# EAGLE board cape (EAGLE 9.4.2)
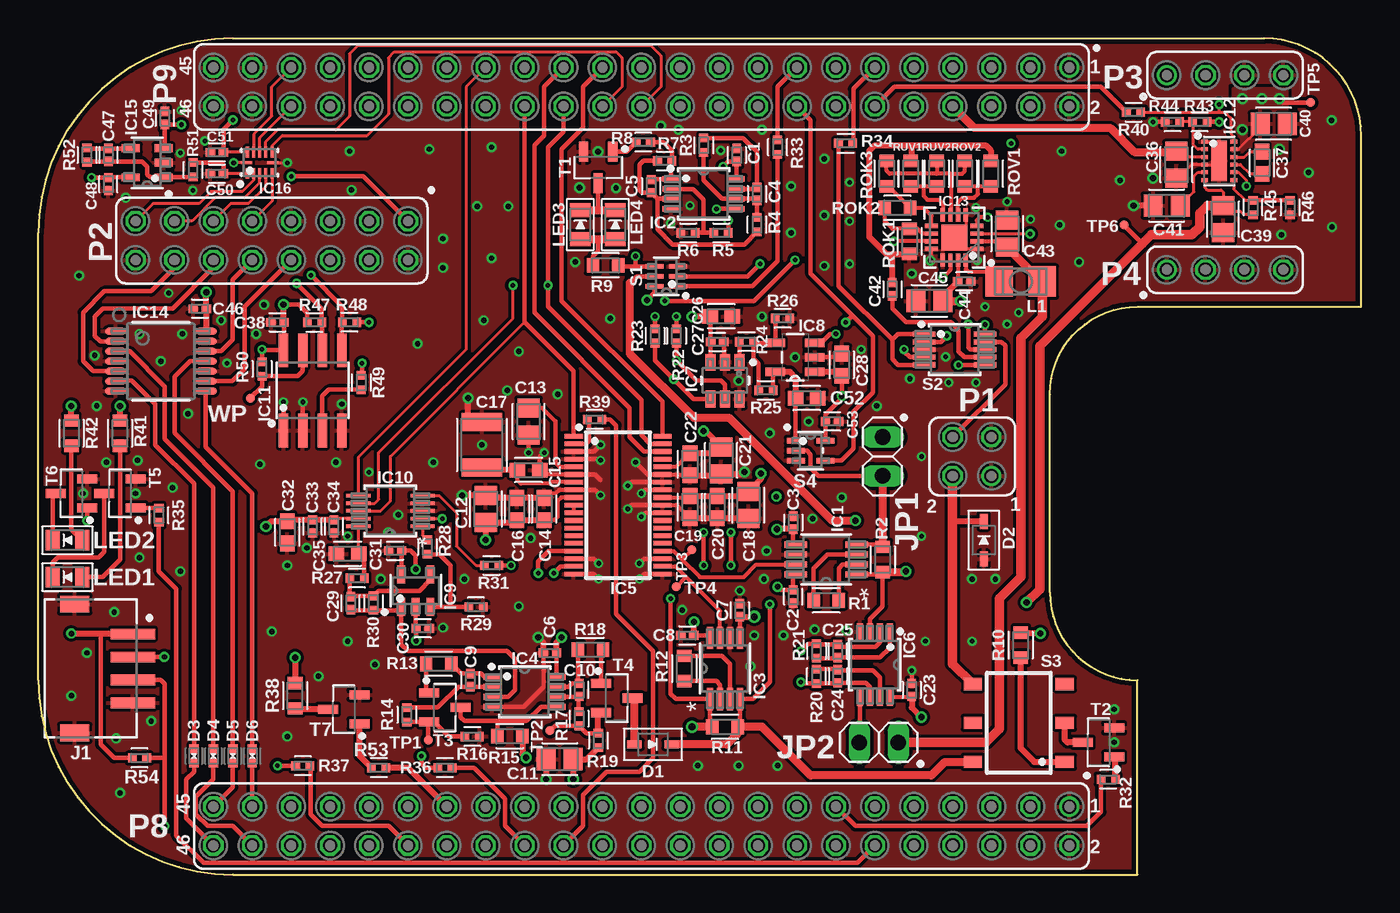
[diagram p8: board, top side]
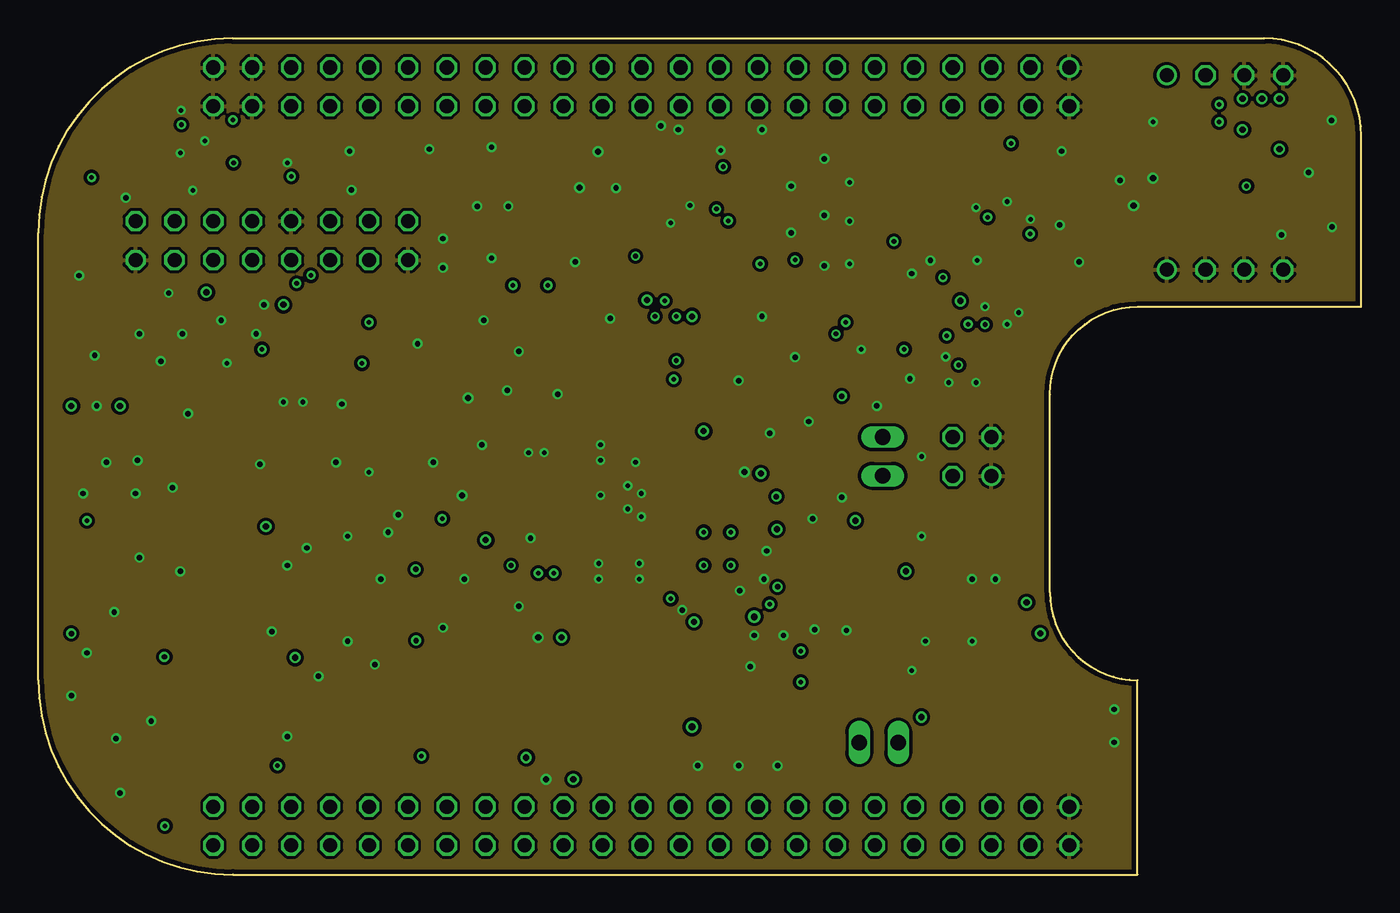
[diagram p9: board, inner layer Ground]
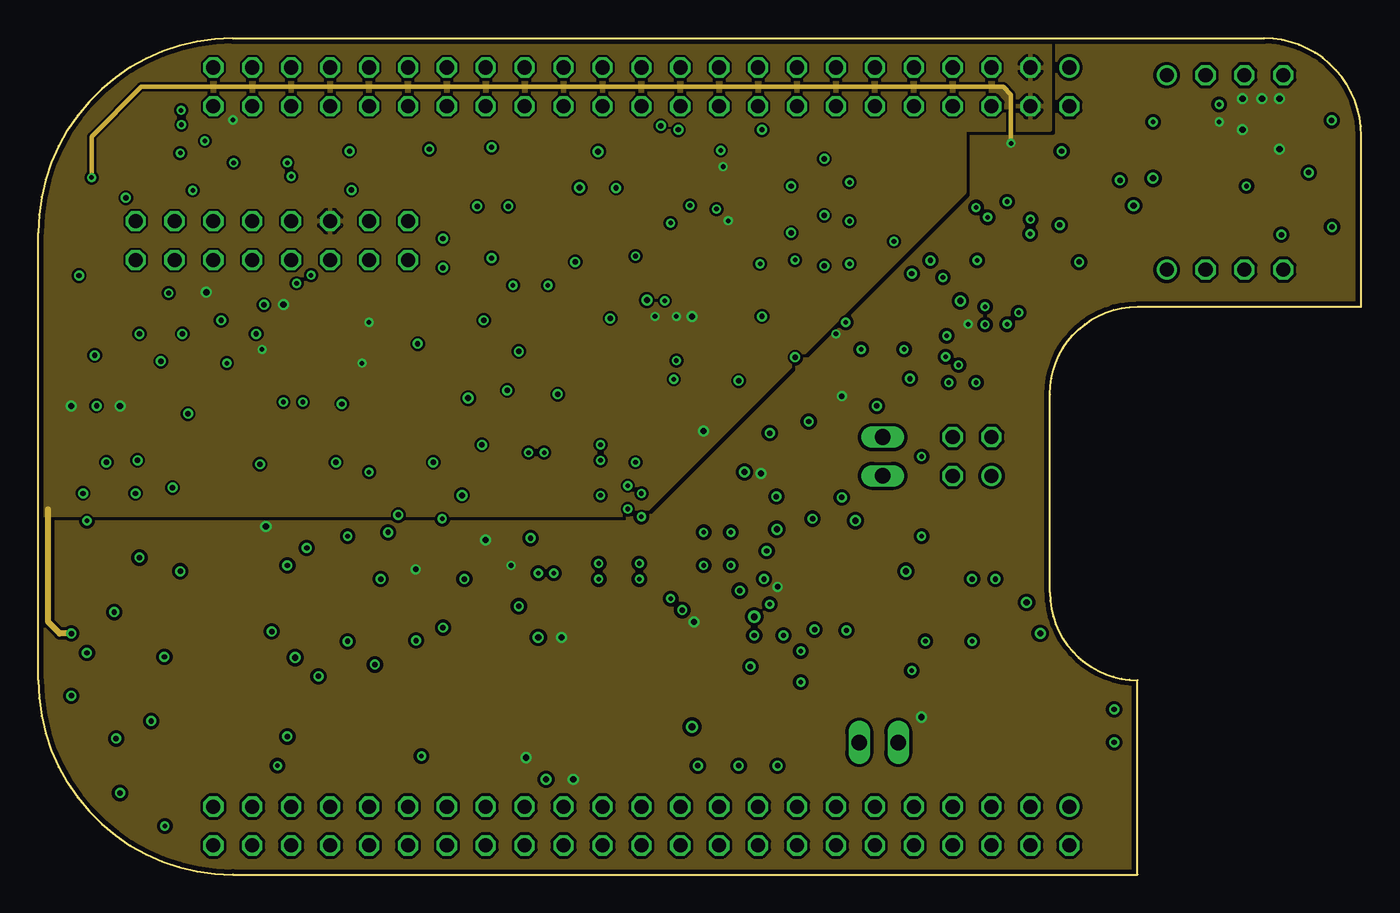
[diagram p10: board, inner layer Power]
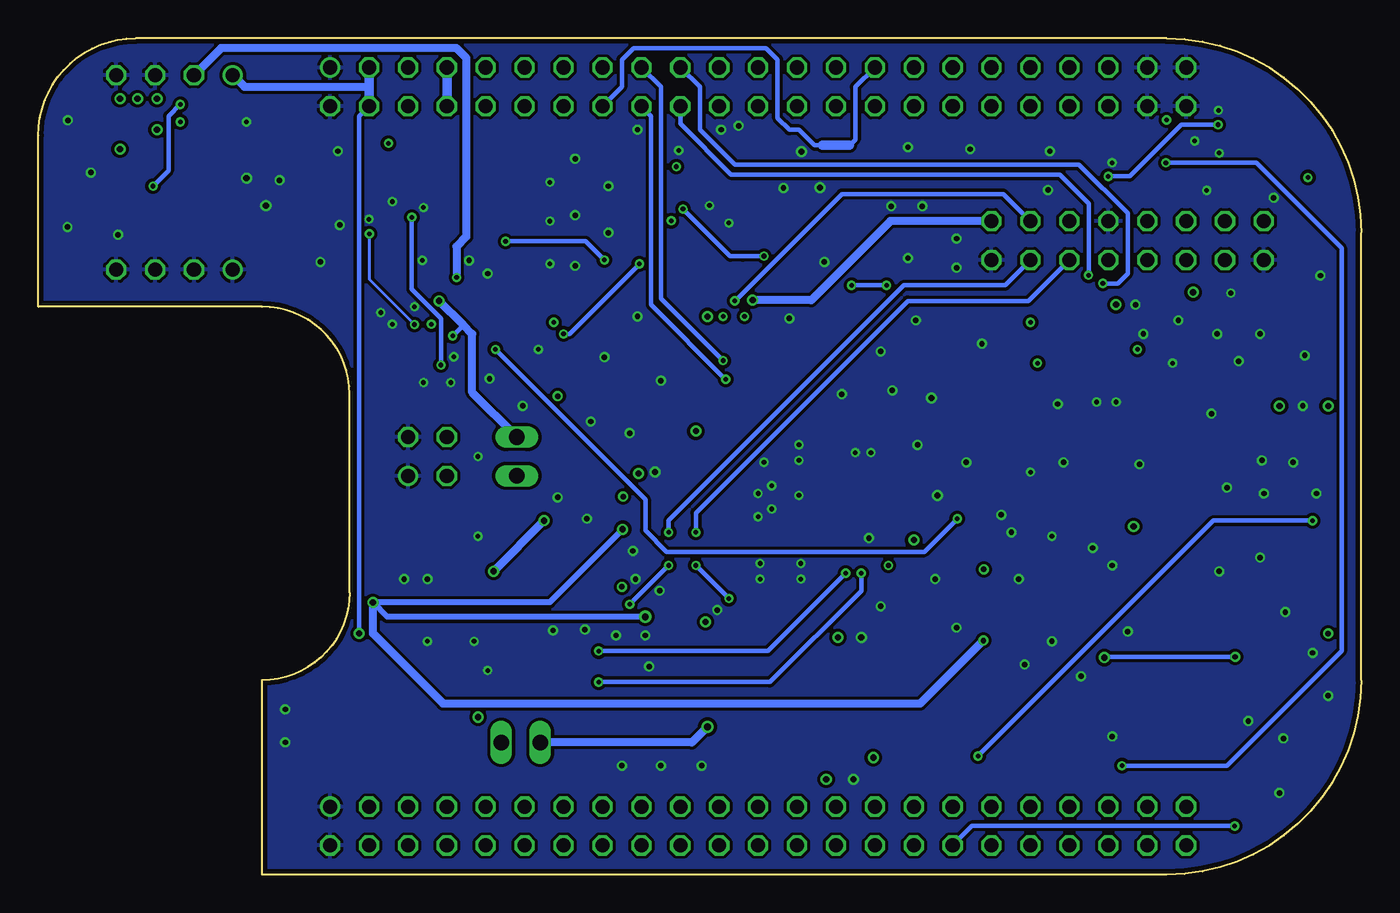
[diagram p11: board, bottom side, seen from below]

Size 86.36 x 54.61 mm. Coordinates in mm from the lower left corner, seen from the top.
Outline: 0,12.7 arc90 12.7,0 71.75,0 71.75,12.7 arc-90 66.04,18.41 66.04,31.37 arc-90 71.75,37.08 86.36,37.08 86.36,48.26 arc90 80.01,54.61 12.7,54.61 arc90 0,41.91 0,12.7
Copper layers (1+2*15+16): Top 0.035mm / dielectric 0.38mm / Ground 0.035mm / dielectric 0.71mm / Power 0.035mm / dielectric 0.38mm / Bottom 0.035mm
Design rules "PCB-POOL Standard_ML4 *": minimum track width 0.15mm, minimum drill 0.3mm, track to track 0.15mm, track to pad 0.15mm, pad to pad 0.15mm, via to via 0.15mm, smd to smd 0.15mm, copper to edge 0.3mm, drill to drill 0.2mm, minimum pad ring 0.2mm, minimum via ring 0.15mm, stop-mask expansion 0.075mm, vias tented up to drill 20mil, thermal gap 0.2mm
tKeepout: area 68.6,15.9 to 86.4,34.3

## Footprints (pad centres in the part's own frame; a part is rotated, then mirrored left to right if it is on the bottom)
CAPC1005X55 = smd 0.608 x 0.562: 1 -0.427,0; 2 0.427,0
CAPC2012X145 = smd 1.234 x 1.453: 1 -0.884,0; 2 0.884,0
CAPC1608X95 = smd 1.024 x 0.954: 1 -0.725,0; 2 0.725,0
CAPC3225X280 = smd 1.178 x 2.625: 1 -1.477,0; 2 1.477,0
SOD2513X110 = smd 0.965 x 0.508: 1 -1.225,0; 2 1.225,0
DIOC1005X55N = smd 0.56 x 0.6: 1 -0.47,0; 2 0.47,0
RM_8-L = smd 1.456 x 0.4: 1 -1.999,0.975; 2 -1.999,0.325; 3 -1.999,-0.325; 4 -1.999,-0.975; 5 1.999,-0.975; 6 1.999,-0.325; 7 1.999,0.325; 8 1.999,0.975
DGK8-L = smd 1.118 x 0.381: 1 -2.121,0.975; 2 -2.121,0.325; 3 -2.121,-0.325; 4 -2.121,-0.975; 5 2.121,-0.975; 6 2.121,-0.325; 7 2.121,0.325; 8 2.121,0.975
TSSOP38 = smd 0.3 x 1.2: 1 -4.5,-2.9; 2 -4,-2.9; 3 -3.5,-2.9; 4 -3,-2.9; 5 -2.5,-2.9; 6 -2,-2.9; 7 -1.5,-2.9; 8 -1,-2.9; 9 -0.5,-2.9; 10 0,-2.9; 11 0.5,-2.9; 12 1,-2.9; 13 1.5,-2.9; 14 2,-2.9; 15 2.5,-2.9; 16 3,-2.9; 17 3.5,-2.9; 18 4,-2.9; 19 4.5,-2.9; 20 4.5,2.9; 21 4,2.9; 22 3.5,2.9; 23 3,2.9; 24 2.5,2.9; 25 2,2.9; 26 1.5,2.9; 27 1,2.9; 28 0.5,2.9; 29 0,2.9; 30 -0.5,2.9; 31 -1,2.9; 32 -1.5,2.9; 33 -2,2.9; 34 -2.5,2.9; 35 -3,2.9; 36 -3.5,2.9; 37 -4,2.9; 38 -4.5,2.9
DAC6571IDBVR = smd 1.1 x 0.65: 1 -1.2,0.95; 2 -1.2,0; 3 -1.2,-0.95; 4 1.2,-0.95; 5 1.2,0; 6 1.2,0.95
SOT95P280X145-5N = smd 1.27 x 0.559: 1 -1.295,0.94; 2 -1.295,0; 3 -1.295,-0.94; 4 1.295,-0.94; 5 1.295,0.94
DBV5-L = smd 1.168 x 0.508: 1 -1.067,0.95; 2 -1.067,0; 3 -1.067,-0.95; 4 1.067,-0.95; 5 1.067,0.95
DGS10 = smd 1.575 x 0.229: 1 -2.095,1; 2 -2.095,0.5; 3 -2.095,0; 4 -2.095,-0.5; 5 -2.095,-1; 6 2.095,-1; 7 2.095,-0.5; 8 2.095,0; 9 2.095,0.5; 10 2.095,1
SO08 = smd 0.61 x 2.21: 1 -1.905,-2.616; 2 -0.635,-2.616; 3 0.635,-2.616; 4 1.905,-2.616; 5 1.905,2.616; 6 0.635,2.616; 7 -0.635,2.616; 8 -1.905,2.616
VREG_LM27762DSSR = smd 0.5 x 0.25: 1 -0.95,1.25; 2 -0.95,0.75; 3 -0.95,0.25; 4 -0.95,-0.25; 5 -0.95,-0.75; 6 -0.95,-1.25; 7 0.95,-1.25; 8 0.95,-0.75; 9 0.95,-0.25; 10 0.95,0.25; 11 0.95,0.75; 12 0.95,1.25 | smd 1 x 2.65: 13 0,0
RGT16_1P7X1P7 = smd 0.85 x 0.28: 1 -1.475,0.75; 2 -1.475,0.25; 3 -1.475,-0.25; 4 -1.475,-0.75; 9 1.475,-0.75; 10 1.475,-0.25; 11 1.475,0.25; 12 1.475,0.75 | smd 0.28 x 0.85: 5 -0.75,-1.475; 6 -0.25,-1.475; 7 0.25,-1.475; 8 0.75,-1.475; 13 0.75,1.475; 14 0.25,1.475; 15 -0.25,1.475; 16 -0.75,1.475 | smd 1.7 x 1.7: 17 0,0
PW0014A_N = smd 1.4 x 0.45: 1 -2.95,1.95; 2 -2.95,1.3; 3 -2.95,0.65; 4 -2.95,0; 5 -2.95,-0.65; 6 -2.95,-1.3; 7 -2.95,-1.95; 8 2.95,-1.95; 9 2.95,-1.3; 10 2.95,-0.65; 11 2.95,0; 12 2.95,0.65; 13 2.95,1.3; 14 2.95,1.95
RUT0012A = smd 0.7 x 0.2: 1 -0.7,0.8; 2 -0.7,0.4; 3 -0.7,0; 4 -0.7,-0.4; 5 -0.7,-0.8; 7 0.7,-0.8; 8 0.7,-0.4; 9 0.7,0; 10 0.7,0.4; 11 0.7,0.8 | smd 0.2 x 0.7: 6 0,-0.85; 12 0,0.85
JST_S4B-ZR-SM4A-TF_0 = smd 0.7 x 2.9: 1 2.25,-2.75; 2 0.75,-2.75; 3 -0.75,-2.75; 4 -2.25,-2.75 | smd 1.1 x 1.9: 5 -4.2,1.05; 6 4.2,1.05
1X02 = drill 1.016 long: 1 -1.27,0; 2 1.27,0
L3225P = smd 1.8 x 2: 1 -1.4,0; 2 1.4,0
LEDC2012X75 = smd 0.91 x 1.35: 1 -0.96,0; 2 0.96,0
FE02-2 = drill 0.914: 1 1.27,1.27 | drill 0.914 octagon: 2 1.27,-1.27; 3 -1.27,1.27; 4 -1.27,-1.27
FE08-2 = drill 0.914 octagon: 1 8.89,1.27; 2 8.89,-1.27; 3 6.35,1.27; 4 6.35,-1.27; 5 3.81,1.27; 6 3.81,-1.27; 7 1.27,1.27; 8 1.27,-1.27; 9 -1.27,1.27; 10 -1.27,-1.27; 11 -3.81,1.27; 12 -3.81,-1.27; 13 -6.35,1.27; 14 -6.35,-1.27; 15 -8.89,1.27; 16 -8.89,-1.27
FE04-1 = drill 0.914: 1 3.81,0 | drill 0.914 octagon: 2 1.27,0; 3 -1.27,0; 4 -3.81,0
FE23-2 = drill 0.914: 1 27.94,1.27 | drill 0.914 octagon: 2 27.94,-1.27; 3 25.4,1.27; 4 25.4,-1.27; 5 22.86,1.27; 6 22.86,-1.27; 7 20.32,1.27; 8 20.32,-1.27; 9 17.78,1.27; 10 17.78,-1.27; 11 15.24,1.27; 12 15.24,-1.27; 13 12.7,1.27; 14 12.7,-1.27; 15 10.16,1.27; 16 10.16,-1.27; 17 7.62,1.27; 18 7.62,-1.27; 19 5.08,1.27; 20 5.08,-1.27; 21 2.54,1.27; 22 2.54,-1.27; 23 0,1.27; 24 0,-1.27; 25 -2.54,1.27; 26 -2.54,-1.27; 27 -5.08,1.27; 28 -5.08,-1.27; 29 -7.62,1.27; 30 -7.62,-1.27; 31 -10.16,1.27; 32 -10.16,-1.27; 33 -12.7,1.27; 34 -12.7,-1.27; 35 -15.24,1.27; 36 -15.24,-1.27; 37 -17.78,1.27; 38 -17.78,-1.27; 39 -20.32,1.27; 40 -20.32,-1.27; 41 -22.86,1.27; 42 -22.86,-1.27; 43 -25.4,1.27; 44 -25.4,-1.27; 45 -27.94,1.27; 46 -27.94,-1.27
RESC1608X55 = smd 0.808 x 0.955: 1 -0.823,0; 2 0.823,0
RESC1005X40 = smd 0.56 x 0.6: 1 -0.47,0; 2 0.47,0
KS_6-L = smd 1.156 x 0.305: 1 -0.768,0.65; 2 -0.768,0; 3 -0.768,-0.65; 4 0.768,-0.65; 5 0.768,0; 6 0.768,0.65
RM_10-L = smd 1.473 x 0.33: 1 -1.994,1; 2 -1.994,0.5; 3 -1.994,0; 4 -1.994,-0.5; 5 -1.994,-1; 6 1.994,-1; 7 1.994,-0.5; 8 1.994,0; 9 1.994,0.5; 10 1.994,1
SOP06 = smd 0.8 x 1.2: 1 -2.54,-3; 2 0,-3; 3 2.54,-3; 4 2.54,3; 5 0,3; 6 -2.54,3
DCK5 = smd 1.168 x 0.356: 1 -0.965,0.65; 2 -0.965,0; 3 -0.965,-0.65; 4 0.965,-0.65; 5 0.965,0.65
SOT95P237X112-3 = smd 1.298 x 0.597: 1 -1.027,0.95; 2 -1.027,-0.95; 3 1.027,0
TP06R = smd 0.6 x 0.6: TP 0,0

## Placement (x,y rotation side)
C1  0.1u  [CAPC1005X55]  45.59,46.99 90 top
C2  0.1u  [CAPC1005X55]  49.28,18.16 270 top
C3  0.1u  [CAPC1005X55]  49.28,22.99 90 top
C4  1n  [CAPC1005X55]  46.91,44.45 90 top
C5  1n  [CAPC1005X55]  40.01,44.96 90 top
C6  0.1u  [CAPC1005X55]  33.4,14.48 180 top
C7  0.1u  [CAPC1005X55]  45.8,17.27 90 top
C8  0.1u  [CAPC1005X55]  42.37,15.62 180 top
C9  1n  [CAPC1005X55]  28.19,12.7 90 top
C10  2.2n  [CAPC1005X55]  35.31,12.06 90 top
C11  10u  [CAPC2012X145]  34.04,7.54 180 top
C12  10u  [CAPC2012X145]  29.21,23.88 90 top
C13  10u  [CAPC2012X145]  32,29.59 270 top
C14  1u  [CAPC1608X95]  33.02,23.88 90 top
C15  1u  [CAPC1608X95]  32,26.42 0 top
C16  1u  [CAPC1608X95]  31.24,23.88 90 top
C17  22u  [CAPC3225X280]  28.96,28.07 90 top
C18  10u  [CAPC2012X145]  46.35,24.13 270 top
C19  1u  [CAPC1608X95]  42.55,24 270 top
C20  1u  [CAPC1608X95]  44.32,24 270 top
C21  10u  [CAPC2012X145]  44.58,27.05 270 top
C22  1u  [CAPC1608X95]  42.55,26.8 270 top
C23  0.1u  [CAPC1005X55]  57.02,12.06 90 top
C24  1n  [CAPC1005X55]  52.2,12.95 90 top
C25  1n  [CAPC1005X55]  52.2,14.61 270 top
C26  1u  [CAPC1608X95]  44.58,36.45 0 top
C27  0.1u  [CAPC1005X55]  44.32,34.8 180 top
C28  1u  [CAPC1608X95]  52.45,33.3 90 top
C29  1n  [CAPC1005X55]  20.4,17.73 270 top
C30  0.1u  [CAPC1005X55]  25.1,16.08 0 top
C31  0.1u  [CAPC1005X55]  23.29,21.16 180 top
C32  1u  [CAPC1608X95]  16.26,22.35 270 top
C33  1n  [CAPC1005X55]  17.91,22.73 270 top
C34  1n  [CAPC1005X55]  19.3,22.73 270 top
C35  1u  [CAPC1608X95]  20.19,20.95 180 top
C36  2.2u  [CAPC2012X145]  74.3,46.35 270 top
C37  0.47u  [CAPC1608X95]  79.88,46.48 270 top
C38  0.1u  [CAPC1005X55]  15.62,36.07 180 top
C39  2.2u  [CAPC2012X145]  77.34,42.8 270 top
C40  2.2u  [CAPC2012X145]  80.64,49.02 0 top
C41  4.7u  [CAPC2012X145]  73.66,43.69 180 top
C42  10n  [CAPC1005X55]  55.75,38.23 90 top
C43  4.7u  [CAPC2012X145]  63.25,41.86 90 top
C44  4.7u  [CAPC2012X145]  58.17,37.47 180 top
C45  0.1u  [CAPC1005X55]  60.45,38.73 0 top
C46  0.1u  [CAPC1005X55]  10.54,36.96 180 top
C47  1n  [CAPC1005X55]  4.57,46.99 90 top
C48  0.1u  [CAPC1005X55]  4.57,45.09 270 top
C49  1n  [CAPC1005X55]  8.26,49.4 90 top
C50  10n  [CAPC1005X55]  11.66,45.77 180 top
C51  0.1u  [CAPC1005X55]  11.66,47.17 180 top
C52  1u  [CAPC1608X95]  50.16,31.11 0 top
C53  0.1u  [CAPC1005X55]  51.82,29.59 0 top
D1  BAT43WS-HE3SOD-323  [SOD2513X110]  40.13,8.51 180 top
D2  BZX384B5V1  [SOD2513X110]  61.72,21.84 270 top
D3  ACDBQC0130L-HF0402  [DIOC1005X55N]  10.16,7.75 270 top
D4  ACDBQC0130L-HF0402  [DIOC1005X55N]  11.43,7.75 270 top
D5  ACDBQC0130L-HF0402  [DIOC1005X55N]  12.7,7.75 270 top
D6  ACDBQC0130L-HF0402  [DIOC1005X55N]  13.97,7.75 270 top
IC1  AD8422BRMZ  [RM_8-L]  51.44,20.57 180 top
IC2  OPA2388DGK8_L  [DGK8-L]  43.43,44.45 0 top
IC3  AD8422BRMZ  [RM_8-L]  44.83,13.46 90 top
IC4  OPA2388DGK8_L  [DGK8-L]  31.75,11.94 0 top
IC5  ADS8694TSSOP38  [TSSOP38]  37.85,24.13 270 top
IC6  OPA2388DGK8_L  [DGK8-L]  54.61,13.72 270 top
IC7  DAC6571IDBVR  [DAC6571IDBVR]  44.83,32.26 270 top
IC8  TPS73101DBVR  [SOT95P280X145-5N]  49.4,33.78 180 top
IC9  LMP7701MF  [DBV5-L]  24.64,18.54 90 top
IC10  DAC8562_DGS_10  [DGS10]  22.99,23.75 180 top
IC11  CAT24C256WI-GT3  [SO08]  17.91,31.62 0 top
IC12  LM27762DSSR  [VREG_LM27762DSSR]  77.09,46.61 0 top
IC13  BQ25504_RGT_16  [RGT16_1P7X1P7]  59.79,41.61 180 top
IC14  SN74LV4T125PWR  [PW0014A_N]  8,33.53 0 top
IC15  LMP7701MF  [DBV5-L]  7.11,46.48 180 top
IC16  TXB0304RUTR  [RUT0012A]  14.45,46.48 90 top
J1  JST_S4B-ZR-SM4A-TFJST_S4B-ZR-SM4A-TF_0_0  [JST_S4B-ZR-SM4A-TF_0]  3.43,13.46 90 top
JP1  [1X02]  55.12,27.3 270 top
JP2  [1X02]  54.86,8.64 180 top
L1  22u  [L3225P]  64.14,38.73 0 top
LED1  598-8130-107FLED_0805  [LEDC2012X75]  1.91,19.43 0 top
LED2  598-8130-107FLED_0805  [LEDC2012X75]  1.91,21.84 0 top
LED3  598-8130-107FLED_0805  [LEDC2012X75]  35.38,42.44 270 top
LED4  598-8130-107FLED_0805  [LEDC2012X75]  37.67,42.44 270 top
P1  [FE02-2]  60.96,27.3 270 top
P2  [FE08-2]  15.24,41.4 0 top
P3  [FE04-1]  77.47,52.2 180 top
P4  [FE04-1]  77.47,39.5 180 top
P8  [FE23-2]  39.37,3.17 0 top
P9  [FE23-2]  39.37,51.44 0 top
R1  402  [RESC1608X55]  51.44,17.91 0 top
R2  2  [RESC1608X55]  55.12,20.57 90 top
R3  24  [RESC1005X40]  43.43,47.62 90 top
R4  2.4k  [RESC1005X40]  46.91,42.44 270 top
R5  3.6k  [RESC1005X40]  44.58,41.91 180 top
R6  10k  [RESC1005X40]  42.42,41.91 180 top
R7  10k  [RESC1005X40]  40.89,46.61 180 top
R8  1.2k  [RESC1005X40]  39.5,47.83 0 top
R9  91  [RESC1608X55]  37.03,39.78 0 top
R10  220  [RESC1608X55]  64.14,14.99 90 top
R11  2  [RESC1608X55]  44.83,9.65 0 top
R12  402  [RESC1608X55]  42.16,13.46 90 top
R13  220  [RESC1608X55]  26.14,13.77 0 top
R14  10k  [RESC1005X40]  24.05,10.44 90 top
R15  402  [RESC1608X55]  30.78,9.04 180 top
R16  1.2k  [RESC1005X40]  28.32,9.02 0 top
R17  10k  [RESC1005X40]  35.31,10.19 90 top
R18  220  [RESC1608X55]  36.04,14.68 180 top
R19  30  [RESC1005X40]  36.55,8.76 90 top
R20  24  [RESC1005X40]  50.8,12.95 270 top
R21  24  [RESC1005X40]  50.8,14.61 90 top
R22  5.6k  [RESC1005X40]  41.66,35.18 90 top
R23  5.6k  [RESC1005X40]  40.26,35.18 90 top
R24  56k  [RESC1005X40]  46.23,34.8 0 top
R25  40.2k  [RESC1005X40]  47.5,31.62 180 top
R26  30k  [RESC1005X40]  48.59,36.32 0 top
R27  100k  [RESC1005X40]  20.8,19.35 0 top
R28  1.2k  [RESC1005X40]  25.4,21.39 90 top
R29  100k  [RESC1005X40]  28.57,17.48 0 top
R30  1.2k  [RESC1005X40]  21.87,17.73 90 top
R31  10k  [RESC1005X40]  29.59,20.19 180 top
R32  510  [RESC1005X40]  69.85,6.22 0 top
R33  510  [RESC1005X40]  48.26,47.5 270 top
R34  510  [RESC1005X40]  52.7,47.75 180 top
R35  510  [RESC1005X40]  7.87,23.47 270 top
R36  510  [RESC1005X40]  26.54,6.99 0 top
R37  510  [RESC1005X40]  17.27,7.11 0 top
R38  220  [RESC1608X55]  16.76,11.68 90 top
R39  510  [RESC1005X40]  36.32,29.72 0 top
R40  510  [RESC1005X40]  71.5,49.78 180 top
R41  220  [RESC1608X55]  5.33,28.83 90 top
R42  220  [RESC1608X55]  2.16,28.83 90 top
R43  300k  [RESC1005X40]  75.82,49.15 0 top
R44  100k  [RESC1005X40]  74.04,49.15 0 top
R45  294k  [RESC1005X40]  79.3,43.56 270 top
R46  100k  [RESC1005X40]  81.71,43.56 90 top
R47  5.6k  [RESC1005X40]  18.03,36.07 180 top
R48  5.6k  [RESC1005X40]  20.32,36.07 0 top
R49  5.6k  [RESC1005X40]  21.08,32.13 90 top
R50  10k  [RESC1005X40]  14.61,33.02 90 top
R51  24  [RESC1005X40]  10.11,46.02 270 top
R52  10k  [RESC1005X40]  3.17,46.99 90 top
R53  510  [RESC1005X40]  22.23,6.99 0 top
R54  10k  [RESC1005X40]  6.6,7.62 0 top
ROK1  5.62M  [RESC1608X55]  56.87,41.35 90 top
ROK2  5.62M  [RESC1608X55]  56.08,43.54 0 top
ROK3  1.87M  [RESC1608X55]  55.37,45.77 90 top
ROV1  5.62M  [RESC1608X55]  62.18,45.77 270 top
ROV2  5.62M  [RESC1608X55]  60.48,45.77 90 top
RUV1  5.62M  [RESC1608X55]  56.95,45.77 270 top
RUV2  3.6M  [RESC1608X55]  58.65,45.77 90 top
S1  ADG849YKSZ-REELKS_6-L  [KS_6-L]  41,39.07 180 top
S2  ADG736LBRMZRM_10-L  [RM_10-L]  59.82,34.29 0 top
S3  G3VM-31HR22SOP  [SOP06]  64.01,9.91 90 top
S4  TMUX1101DCK  [DCK5]  50.42,27.69 0 top
T1  SI2374DSSOT23-VSHAY  [SOT95P237X112-3]  36.55,46.18 270 top
T2  SI2374DSSOT23-VSHAY  [SOT95P237X112-3]  69.22,8.64 180 top
T3  SI2374DSSOT23-VSHAY  [SOT95P237X112-3]  26.54,10.92 0 top
T4  SI2307SOT23-VSHAY  [SOT95P237X112-3]  37.77,11.53 0 top
T5  SI2374DSSOT23-VSHAY  [SOT95P237X112-3]  5.33,24.89 180 top
T6  SI2374DSSOT23-VSHAY  [SOT95P237X112-3]  2.16,24.89 180 top
T7  SI2374DSSOT23-VSHAY  [SOT95P237X112-3]  19.94,10.79 180 top
TP1  TPSQTP06R  [TP06R]  25.45,8.79 0 top
TP2  TPSQTP06R  [TP06R]  33.4,9.4 0 top
TP3  TPSQTP06R  [TP06R]  42.67,21.21 0 top
TP4  TPSQTP06R  [TP06R]  41.66,18.8 0 top
TP5  TPSQTP06R  [TP06R]  83.06,50.42 0 top
TP6  TPSQTP06R  [TP06R]  70.87,42.42 0 top
U$1  [REFMARK]  2.16,43.94 0 top
U$2  [REFMARK]  4.39,6.45 0 top
U$3  [REFMARK]  68.83,45.59 0 top
WP  TPSQTP06R  [TP06R]  13.84,31.11 0 top

## Tracks (layer width: path | path; a pad name or v marks a point on that pad's centre or on a via)
+3V3  (via drill 0.3, 0.35, 0.4)
  Top 0.203: IC16.11 12.1,47.18 C51.1
  Top 0.254: 42.55,27.43 42.42,27.43 41.62,26.63 IC5.34
  Top 0.305: C38.1 16.05,34.28 IC11.8 14.66,34.24 v14.61,34.29 R50.2 | IC7.3 43.88,34.78 C27.2 43.9,36.41 C26.1 | 42.55,27.43 C22.1 | R47.2 17.56,36.66 17.02,37.21 v16,37.21 | R48.2 v21.59,36.07 | IC2.8 45.59,45.46 C1.1 45.04,46.56 v44.7,46.23 | R23.2 v40.26,36.45 | R22.2 v41.66,36.45 | R49.2 21.13,32.65 v21.13,33.4 | R5.1 45.05,42.68 v45.03,42.7 | C51.1 12.09,48.66 v12.7,49.28 | R54.1 4.95,7.62 4.06,8.51 4.06,15.71
  Top 0.406: v65.41,15.75 64.2,15.75 R10.2 | C22.1 44.16,27.52 C21.1 43.56,28.96 v43.43,28.96 | v10.97,38.02 C46.1 10.97,35.49 IC14.14 | C38.1 16,36.11 v16,37.21 | C26.1 v42.67,36.45 | R42.2 v2.16,30.61 | R41.2 v5.33,30.61 | J1.1 4.06,15.71 2.19,15.71 v2.16,15.75
  Power 0.406: v2.16,15.75 1.4,15.75 0.64,16.51 0.64,23.88
  Bottom 0.305: v65.41,15.75 65.41,49.53 P9.4
  Bottom 0.508: P3.1 72.9,51.44 64.77,51.44
  Bottom 0.61: P9.3 64.77,51.44 P9.4
  pour Power: 0,23.5 0,54.61 66.04,54.61 66.04,48.64 60.45,48.64 60.45,44.58 39.37,23.5
+5V
  Top 0.203: IC12.3 74.67,46.86 74.36,47.18 C36.1
  Top 0.508: P9.8 61.09,48.76 65.65,48.76 65.66,48.77 69.98,48.77 71.57,47.18 74.36,47.18
  Bottom 0.61: P9.8 P9.7
BUTTON_LED_OD  (via drill 0.35, 0.4)
  Top 0.305: J1.2 8.22,14.21 v8.23,14.22
  Top 0.406: v16.76,14.17 R38.2
  Bottom 0.305: v8.23,14.22 16.71,14.22 v16.76,14.17
CS_ADC
  Top 0.305: P9.25 35.56,51.44 35.56,48.77 34.16,47.37 34.16,37.47 40.75,30.88 IC5.38
CS_DAC
  Top 0.203: P9.31 27.94,51.44 27.94,34.29 20.89,27.24 IC10.6
EN_HRVST
  Top 0.406: R32.2 70.32,7.61 T2.1
EN_LVLCNV  (via drill 0.3)
  Top 0.203: IC16.12 v12.75,46.48 | v12.75,46.48
  Top 0.305: R37.1 v15.62,7.11
  Bottom 0.305: v15.62,7.11 8.76,7.11 1.27,14.61 1.27,40.89 6.86,46.48 v12.75,46.48
EN_MPPT#
  Top 0.305: S2.5 56.12,33.29 55.75,33.66 55.75,34.92 | S2.1 56.12,35.29 55.75,34.92 | 55.75,34.92 52.23,38.44 R34.2
EN_V_ANLG  (via drill 0.3)
  Top 0.203: IC12.8 78.35,45.86 78.87,45.34 v78.87,44.96 | R40.1 77.09,49.78 | 77.09,49.78 77.47,49.78 77.85,49.4 77.85,48.39 78.04,48.2 IC12.12 | 77.09,49.78 v77.09,50.29
  Bottom 0.305: v77.09,50.29 77.85,49.53 77.85,45.97 v78.87,44.96
EN_V_FIX  (via drill 0.3)
  Top 0.305: S4.4 52.44,27.04 53.21,27.81 53.21,30.23 54.48,31.5 54.48,35.18 53.15,36.51 | P9.16 50.42,49.28 50.42,39.24 53.15,36.51 | 53.15,36.51 v52.7,36.07
  Bottom 0.305: P9.29 33.02,51.44 33.02,48.01 33.4,47.62 | 35.18,47.62 35.69,47.62 36.7,48.64 37.34,48.64 38.1,49.4 38.1,53.21 38.86,53.98 47.5,53.98 48.26,53.21 48.26,51.44 P9.16
  Bottom 0.61: 33.4,47.62 35.18,47.62
GND  (via drill 0.3, 0.35, 0.4)
  Top 0.203: C36.2 74.43,45.47 75.31,46.36 IC12.4 76.84,46.36 IC12.13 77.09,47.37 76.6,47.86 IC12.1 | IC16.6 | IC16.6 v16.26,46.48 | IC13.1 60.49,40.85 59.79,41.55 59.33,41.55 59.18,41.4 59.59,41.4 IC13.17 60.54,42.35 IC13.5 | IC13.12 58.32,40.18 v58.24,40.11
  Top 0.254: IC5.29 41.66,24.13 42.51,23.28 C19.2 | IC5.33 42.49,26.13 C22.2 | IC5.6 33.02,26.13 C15.2 | IC5.8 34.02,25.13 33.78,24.89 33.31,24.89 C14.2 | IC13.12 58.29,40.83 | 56.98,40.39 56.85,40.51
  Top 0.305: IC5.33 39.78,26.13 v38.99,26.92 | IC5.32 38.71,25.63 v38.48,25.4 | v36.7,24.77 36.34,25.13 IC5.8 | IC5.6 36.35,26.13 36.7,25.78 | IC5.3 36.27,27.63 v36.7,28.07 | IC5.4 36.62,27.13 v36.7,27.05 | IC5.31 39.61,25.13 v39.37,24.89 | IC5.29 38.73,24.13 v38.48,23.88 | v39.37,23.37 39.63,23.63 IC5.28 | IC11.1 v16,30.86 | IC11.2 v17.27,30.86 | C23.2 v57.02,13.34 | C15.2 32.73,27.27 v33.02,27.56 | C13.2 v32,27.56 | IC5.19 36.25,19.63 v36.58,19.3 | IC5.17 36.27,20.63 v36.58,20.32 | IC5.20 39.57,19.63 v39.24,19.3 | IC5.22 39.55,20.63 v39.24,20.32 | C6.2 32.97,12.27 31.66,10.96 IC4.4 | C27.1 44.75,33.54 IC7.2 | R44.1 v72.77,49.15 | IC8.2 52.21,33.78 C28.2
  Top 0.406: C19.2 C20.2 46.32,23.28 C18.2 | C22.2 44.48,26.07 C21.2 45.98,26.17 v46.1,26.29 | C14.2 C16.2 29.37,24.6 C12.2 v27.66,24.76 v27.66,24.77 | C41.2 v71.5,43.69 | C17.2 28.24,29.54 28.07,29.72 v28.07,31.11 | C6.2 32.97,15.16 v32.64,15.49 | C11.2 v33.15,6.23 v33.15,6.22 | 57.02,47.62 54.61,47.62 54.23,47.24 54.23,41.66 55.37,40.51 55.75,40.51 | 57.02,47.62 61.85,47.62 62.18,47.3 ROV1.1 | RUV1.1 57.02,46.67 57.02,47.62 | 55.75,40.51 56.85,40.51 ROK1.1 | C42.2 55.75,40.51
  other vias: 72.77,45.47 36.55,47.22 35.33,44.85 44.55,47.29 41.27,42.55 42.55,43.69 56.9,32.38 54.74,30.61 37.34,36.32 35.05,40.01 41.78,48.64 40.64,48.9 47.24,48.64 29.59,47.5 28.65,43.64 30.68,43.64 29.59,40.26 26.42,41.53 26.42,39.62 19.43,26.92 16.26,20.19 17.53,21.34 31.37,17.53 42.04,17.27 52.76,15.95 47.55,21.13 50.55,23.24 46.48,13.59 46.74,15.62 45.8,18.54 48.64,15.62 47.37,19.3 50.67,16 30.61,31.62 28.96,28.07 31.37,34.16 32.13,21.97 25.78,26.92 20.45,44.7 29.08,36.2 61.8,37.08 63.25,35.94 64.01,36.7 59.23,33.81 59.44,32.13 61.21,32.13 57.66,27.3 57.66,22.1 57.91,15.24 60.96,15.24 6.35,24.89 2.92,24.89 4.45,26.92 45.72,32.26 49.4,33.78 47.24,36.45 70.23,10.79 70.23,8.64 60.96,19.3 62.48,19.3 43.05,7.11 45.72,7.11 48.26,7.11 81.15,41.78 84.45,42.29 84.43,49.25 82.93,45.85 14.73,37.21 14.22,35.31 20.19,22.1 23.5,23.5 20.32,47.24 25.53,47.37 37.72,44.83 2.67,39.12 21.59,26.29 26.42,16.13 22.83,22.35 27.81,19.3 24.77,34.67 22.35,19.3 9.27,47.12 10.87,47.9 10.08,44.68 9.32,49.91 5.71,44.2 12.32,33.4 8.51,37.97 61.29,40.11 61.21,43.56 64.77,42.8 63.25,43.94 57.02,39.24 52.96,39.88 52.96,45.21 52.96,42.67 6.48,27.05 66.8,47.24 70.61,45.34 66.67,42.42 67.94,40.01 21.97,13.72 3.81,30.61 19.81,30.73 33.91,31.37 51.31,46.74 51.31,43.05 51.31,39.75 49.15,44.96 49.15,41.91 53.72,34.29 50.29,29.59 47.75,28.83 52.45,24.64 5.08,8.89 7.37,10.03 5.33,5.33 2.16,11.68 3.17,14.48 4.95,17.14 6.6,20.7 9.27,19.81 8.76,25.27 15.24,15.88 16.26,9.02 18.29,12.95 20.19,15.24 6.6,35.31 9.4,35.31 8,33.53 11.94,36.2 3.68,33.91 14.48,26.8 9.78,30.1
  pour Ground (isolate 0.203): 0,54.61 86.36,54.61 86.36,0 0,0
  pour Top (isolate 0.203, rank 2): 0,54.61 86.36,54.61 86.36,0 0,0
  pour Bottom (isolate 0.203, rank 2): 0,54.61 86.36,54.61 86.36,0 0,0
GND1  (via drill 0.35)
  other vias: 48.18,24.69
GND_BAN
  cutout Top: 56.39,37.08 53.47,37.08 53.47,48.39 63.12,48.39 63.12,44.2 60.45,44.2 60.45,40.89 56.39,40.89
GPIO0_BB
  Top 0.305: P8.45 12.7,5.71 D5.2
GPIO0_TARGET
  Top 0.305: P2.10 12.7,38.86 12.7,34.92 11.95,34.18 IC14.12
GPIO1_BB
  Top 0.305: P8.46 9.65,3.68 9.65,6.22 10.16,6.73 D3.2
GPIO1_TARGET
  Top 0.305: P2.14 8.89,39.62 7.37,38.1 4.32,38.1 2.92,36.7 2.92,33.53 3.57,32.88 IC14.5
GPIO2_BB
  Top 0.305: P8.43 D6.2
GPIO2_TARGET
  Top 0.305: P2.8 13.46,37.08 13.46,33.02 12.67,32.23 IC14.9
GPIO3_BB
  Top 0.305: P8.44 12.7,3.17 11.05,3.17 10.29,3.94 10.29,5.08 11.43,6.22 D4.2
GPIO3_TARGET
  Top 0.305: P2.12 11.43,39.62 8.76,36.96 4.19,36.96 3.68,36.45 3.68,35.18 4.06,34.8 5.02,34.8 IC14.2
I2C1_SCL  (via drill 0.3)
  Top 0.305: IC7.5 44.83,32 44.58,32.26 42.96,32.26 v41.66,33.57 R22.1
  Bottom 0.305: P9.17 45.72,51.44 45.72,37.63 v41.66,33.57
I2C1_SDA  (via drill 0.3)
  Top 0.305: IC7.4 42.77,31.06 v41.48,32.34 40.26,33.57 R23.1
  Bottom 0.305: P9.18 46.35,49.53 46.35,37.21 v41.48,32.34
I2C2_SCL  (via drill 0.3)
  Top 0.305: IC11.6 18.54,36.03 R47.1 18.5,36.97 v16.87,38.61
  Bottom 0.305: P9.19 43.18,51.44 43.18,48.64 40.89,46.35 18.41,46.35 15.24,43.18 15.24,39.24 15.88,38.61 v16.87,38.61
I2C2_SDA  (via drill 0.3)
  Top 0.305: IC11.5 19.81,36.03 R48.1 19.85,37.1 v17.8,39.14
  Bottom 0.305: P9.20 44.45,49.02 41.15,45.72 19.68,45.72 17.78,43.81 17.78,39.17 v17.8,39.14
LED_BUTTON
  Top 0.406: R53.1 20.97,7.77 T7.1
LED_USR1
  Top 0.305: R35.1 T5.1
LED_USR2  (via drill 0.3)
  Top 0.305: T6.1 3.19,23.12 v3.17,23.11 | R36.1 25.27,6.99 25.02,7.24 v25.02,7.75
  Bottom 0.305: v25.02,7.75 9.65,23.11 v3.17,23.11
MISO
  Top 0.305: IC5.36 39.55,27.63 38.61,28.57 38.61,30.48 32.38,36.7 32.38,47.62 33.02,48.26 33.02,51.44 P9.27
MOSI
  Top 0.203: IC10.8 22.35,23.75 22.99,24.38 22.99,27.3 31.75,36.07
  Top 0.305: P9.30 31.75,36.07 34.95,32.87 IC5.1
N$1
  Top 0.305: T1.1 38.4,47.2 R8.1
N$2
  Top 0.305: R9.1 36.21,40.4 36.52,40.72 36.52,41.48
  Top 0.508: LED3.2 36.52,41.48 LED4.2
N$3
  Top 0.406: R10.1 64.14,8.26 65.02,7.37 S3.1
N$4
  Top 0.305: C5.2 40.05,45.42 IC2.1 41.31,46.56 R7.1 41.36,47.28 40.82,47.83 R8.2
N$5
  Top 0.305: T5.3 4.31,21.07 3.94,20.7 1.27,20.7 0.94,20.38 LED1.1
N$6
  Top 0.305: P8.13 53.34,3.17 68.45,3.17 69.38,4.1 R32.1
N$7
  Top 0.305: R25.1 47.97,32.7 IC8.5 | S4.1 C52.1
  Top 0.406: IC8.5 49.07,32.84 49.44,32.48 C52.1
N$8
  Top 0.305: IC4.1 29.12,12.91 28.91,13.13 C9.2 27.6,13.13 R13.2
N$9
  Top 0.305: IC4.2 28.2,12.26 C9.1 27.44,12.27 26.07,10.91 R14.2
N$10
  Top 0.254: 33.78,29.59 32.9,30.48 C13.1
  Top 0.305: IC5.5 34.08,26.63 33.78,26.92 33.78,29.59
N$11
  Top 0.305: R25.2 47.03,33.36 46.7,33.69 R24.2 46.77,34.72 IC8.4 48.12,34.73 R26.1
N$12
  Top 0.254: C15.1 31.28,25.74 31.5,25.53 33.4,25.53 33.5,25.63 IC5.7
  Top 0.406: C15.1 29.13,26.42 C17.1
N$13
  Top 0.305: T1.3 36.55,43.43 36.58,43.4
  Top 0.508: LED3.1 36.58,43.4 LED4.1
N$14
  Top 0.305: P9.15 48.26,51.44 R33.1
N$15
  Top 0.254: IC5.10 IC5.11
N$16
  Top 0.203: IC12.2 75.7,47.36 75.4,47.66 75.4,49.1 R43.1 R44.2
N$17
  Top 0.305: R24.1 45.78,34.77 IC7.1
N$18
  Top 0.305: IC2.3 40.41,44.12 | 40.41,44.12 C5.1 39.42,44.53 39.24,44.7 39.24,46.35 39.5,46.61 R7.2 | 40.41,44.12 40.41,42.14 41.4,41.15 46.09,41.15 R4.2
N$19
  Top 0.203: 62.22,39.38 62.23,39.37 62.29,39.31 62.73,38.87 L1.1
  Top 0.254: IC13.16 60.54,39.53 60.69,39.38 62.22,39.38
N$20
  Top 0.203: IC10.5 26.18,24.75 27.3,23.62 27.3,21.46 28.57,20.19 R31.2
N$21
  Top 0.305: IC11.7 17.27,32.89 16.93,32.55 R50.1 14.61,31.88 WP.TP
N$22
  Top 0.305: R6.1 43.43,41.91 | 43.43,41.91 R5.2 | 43.43,41.91 43.43,44.07 42.73,44.77 IC2.2
N$23
  Top 0.203: IC12.7 78.04,44.77 78.78,44.03 R45.1
  Top 0.305: R45.1 R46.2
N$24
  Top 0.305: R4.1 C4.1 46.81,44.12 IC2.6 44.65,44.12 43.43,45.34 R3.1
N$25
  Top 0.305: IC2.7 46.81,44.77 C4.2 46.91,47.19 46.01,48.09 R3.2
N$26
  Top 0.305: IC11.3 18.54,31.24 18.96,31.66 R49.1
N$27
  Top 0.305: R39.2 37.34,29.72 37.72,29.34 37.72,17.02 40.13,14.61 40.13,7.62 39.24,6.73 37.08,6.73 35.56,5.21 35.56,3.17 P8.28
N$28
  Top 0.406: P8.33 24.13,6.99 R53.2
N$29
  Top 0.305: R1.2 52.26,20 52.51,20.25 IC1.2
N$30
  Top 0.305: P8.36 22.86,3.17 18.54,3.17 17.78,3.94 17.78,7.07 R37.2
N$31
  Top 0.305: R1.1 50.61,20 51.51,20.9 IC1.3
N$32
  Top 0.305: LED1.2 4.19,19.43 5.33,20.57 R41.1
N$33
  Top 0.203: C41.1 75.44,44.58 75.44,45.59 75.7,45.86 IC12.5
N$34
  Top 0.305: P8.12 53.47,0.76 10.79,0.76 9.02,2.54 9.02,18.67 7.87,19.81 R35.2
N$35
  Top 0.305: LED2.1 0.94,24.7 T6.3
N$36
  Top 0.305: LED2.2 2.16,22.55 R42.1
N$37
  Top 0.305: P9.11 53.21,51.31 53.21,47.79 R34.1
N$38
  Top 0.305: P8.30 30.48,3.17 30.48,4.95 28.45,6.99 R36.2
N$39
  Top 0.508: D1.2 38.91,11.42 T4.3
N$40
  Top 0.203: IC12.9 78.48,46.36 79.08,45.76 C37.2
N$41
  Top 0.203: IC12.10 78.74,46.86 79.08,47.21 C37.1
N$42
  Top 0.305: IC6.1 55.59,14.82 54.95,14.18 C25.2 52.15,14.13 R21.1
N$43
  Top 0.305: IC14.3 5.95,34.18 8.26,31.88 8.26,28.45 11.43,25.27 D4.1
N$44
  Top 0.305: R12.2 44.64,14.29 45.16,13.77 IC3.3
N$45
  Top 0.305: IC3.2 44.51,12.39 44.26,12.64 R12.1
N$46
  Top 0.305: R52.1 3.22,46.56 C47.1 6.78,46.56 7.11,46.23 7.11,45.72 7.3,45.53 IC15.1 8.2,45.55 R51.2
N$47
  Top 0.305: IC14.6 5.08,32.26 6.1,32.26 7.62,30.73 7.62,28.07 10.16,25.53 D3.1
N$48
  Top 0.305: 20.44,18.2 R30.2 22.21,18.54 24.89,18.54 25.59,19.24 IC9.4 | 20.44,18.2 C29.1 | R27.1 20.33,18.31 20.44,18.2
N$49
  Top 0.305: IC6.7 54.94,12.88 54.48,13.34 52.24,13.34 C24.2 52.15,13.42 R20.1
N$50
  Top 0.305: D6.1 13.97,24.89 10.92,27.94 10.92,31.55 IC14.8
N$51
  Top 0.305: D5.1 12.7,25.02 8.89,28.83 8.89,32.51 9.91,33.53 IC14.11
N$52
  Top 0.406: T2.3 67.18,8.64 67.01,8.81 S3.2
N$53
  Top 0.406: T7.3 16.83,10.79 R38.1
N$54
  Top 0.305: R28.1 26.2,20.92 26.92,20.19 26.92,17.48 | IC9.3 26.92,17.48 | 26.92,17.48 R29.1
N$55
  Top 0.305: R52.2 3.22,47.42 C47.2 6.03,47.42 IC15.4
N$57
  Top 0.305: T3.1 25.31,12.07 R13.1
N$58
  Top 0.305: T3.2 25.84,9.97 26.8,9.02 R16.1 | T3.2 R14.1 | TP1.TP 25.45,9.91 T3.2
N$59
  Top 0.305: T3.3 27.57,10.28 27.81,10.03 29.97,10.03 | 29.97,10.03 31.88,10.03 32.81,10.96 IC4.5 | R15.2 29.97,9.05 29.97,10.03
N$60
  Top 0.305: IC4.6 35.28,11.61 | 35.28,11.61 C10.1 | R17.2 35.28,10.68 35.28,11.61
N$61
  Top 0.305: IC4.7 34.62,12.26 34.84,12.49 C10.2 35.22,12.58 R18.2
N$62
  Top 0.305: T4.1 36.74,14.56 R18.1
N$63
  Top 0.305: 36.73,10.57 T4.2 | TP2.TP 33.72,9.71 R17.1 35.79,9.23 R19.2
  Top 0.406: R19.2 36.55,10.39 36.68,10.52
  Top 0.508: 36.68,10.52 36.73,10.57
N$103
  Top 0.305: P9.12 55.88,51.44 69.38,51.44 R40.2
RST/PDN_ADC
  Top 0.305: IC5.2 35.75,28.13 35.94,28.32 35.94,29.63 R39.1
SCLK  (via drill 0.3)
  Top 0.203: IC10.7 21.96,24.25 22.23,24.51 22.23,27.56 30.99,36.32 v30.99,38.48
  Top 0.305: IC5.37 39.94,28.13 39.37,28.7 39.37,30.99 33.27,37.08 v33.27,38.48 33.27,47.5 34.29,48.51 P9.28
  Bottom 0.305: v33.27,38.48 v30.99,38.48
SENSE_BUTTON  (via drill 0.3)
  Top 0.305: J1.3 7.99,12.71 8.26,12.45 8.26,7.62 | 8.26,7.62 v8.26,3.17 | R54.2 8.26,7.62
  Bottom 0.305: P8.34 25.4,3.17 v8.26,3.17
SLCT_LOAD
  Top 0.305: S1.1 46.62,38.41 48.26,40.06 R33.2
SWDCLK_BB
  Top 0.203: IC16.9 14.46,48.11 P9.42
SWDCLK_TARGET
  Top 0.203: IC16.3 14.46,45.19 13.46,44.2 11.56,44.2 10.03,42.67 P2.13
SWDIO_BB
  Top 0.203: IC16.10 14.06,48.35 15.24,49.53 15.24,51.44 P9.41
SWDIO_TARGET
  Top 0.203: IC16.2 14.05,45.34 13.31,44.6 11.28,44.6 10.49,43.81 7.49,43.81 P2.15
UART_RX_BB
  Top 0.203: IC16.7 15.25,47.59 15.93,48.26 21.46,48.26 22.86,49.66 22.86,53.34 23.24,53.72 37.72,53.72 38.1,53.34 38.1,51.44 P9.26
UART_RX_TARGET
  Top 0.203: IC16.4 14.86,44.96 13.72,43.81 12.57,43.81 P2.11
UART_TX_BB
  Top 0.203: IC16.8 14.85,47.87 15.62,48.64 19.43,48.64 20.32,49.53 20.32,53.59 20.87,54.15 39.96,54.15 40.64,53.47 40.64,51.44 P9.24
UART_TX_TARGET
  Top 0.203: IC16.5 15.26,43.96 P2.9
V_AIN
  Top 0.254: IC5.21 41.59,20.13 42.29,19.43 | TP4.TP 42.29,19.43 | IC3.7 44.51,17.22 42.29,19.43
V_AOUT
  Top 0.254: IC5.23 41.48,21.13 42.04,20.57 | 42.04,20.57 43.18,19.43 46.05,19.43 46.86,20.24 49.43,20.24 IC1.7 | TP3.TP 42.04,20.57
V_BAT  (via drill 0.3)
  Top 0.254: IC13.14 59.54,39.48 v59.05,38.99
  Bottom 0.508: P3.2 74.42,53.98 59.05,53.98 58.42,53.34 58.42,41.66 59.05,41.02 v59.05,38.99
V_BATOK  (via drill 0.3)
  Top 0.254: IC13.11 v55.86,41.35 v55.85,41.35
  Top 0.305: v40.89,37.47 46.74,37.47 v49.4,40.13
  Bottom 0.305: P2.3 23.37,44.45 33.91,44.45 v40.89,37.47 | v49.4,40.13 50.62,41.35 v55.85,41.35
V_BQ
  Top 0.254: IC13.2 62.87,41.35 C43.1
  Top 0.508: C43.1 65.49,38.73 L1.2
  Top 0.61: JP2.1 61.85,8.64 62.74,9.53 62.74,18.03 64.14,19.43 64.14,35.05 65.53,36.45 L1.2
V_CREF
  Top 0.305: S2.7 60.44,33.79 60.07,34.16 60.07,35.56 59.56,36.07 56.64,36.07 55.75,36.96 C42.1
V_EMU_I
  Top 0.203: IC10.1 25.08,22.17 R28.2
V_EMU_I_BIASED
  Top 0.305: C29.2 20.44,17.26 R30.1 23.47,17.26 IC9.1 23.69,15.05 24.13,14.61 30.61,14.61 31.11,14.1 31.11,12.06 30.66,11.61 IC4.3
V_EMU_V  (via drill 0.3)
  Top 0.203: IC10.2 26.36,23.25 v26.36,23.24
  Top 0.305: S2.4 56.89,33.79 56.52,34.16 v56.52,34.29
  Bottom 0.305: v26.36,23.24 28.52,21.08 45.34,21.08 46.74,22.48 46.74,24.51 v56.52,34.29
V_H
  Top 0.406: D2.1 59.77,23.07 59.69,22.99
  Top 0.61: S3.4 59.69,13.76 59.69,22.99 P1.2
V_IN_SHT+  (via drill 0.3)
  Top 0.305: v45.21,20.19 v45.21,22.35 | R11.2 45.81,9.8 IC3.4 46.64,11.46 47.75,12.57 v47.75,17.65
  Top 0.508: S3.6 59.18,7.37 58.29,6.48 50.42,6.48 47.24,9.65 R11.2 45.65,9.21 44.96,8.51 D1.1
  Bottom 0.305: v45.21,22.35 45.21,23.11 29.84,38.48 23.24,38.48 P2.4 | v47.75,17.65 v45.21,20.19
V_IN_SHT-  (via drill 0.3, 0.45)
  Top 0.305: v43.43,20.19 v43.43,22.35 | R11.1 43.86,9.8 IC3.1 41.62,11.46 41.27,11.81 v41.27,18.03 | IC6.5 53.63,8.68 JP2.2
  Top 0.508: R11.1 v42.67,9.65
  Bottom 0.305: v43.43,22.35 43.43,23.62 29.59,37.47 21.72,37.47 P2.6 | v43.43,20.19 v41.27,18.03
  Bottom 0.508: v42.67,9.65 43.69,8.64 JP2.2
V_LD_SHT+
  Top 0.305: IC1.4 54.97,21.55 R2.2 | S4.2 50.16,27.69 50.42,27.43 50.42,26.54 50.93,26.04 JP1.2
  Top 0.508: JP1.2 55.12,21.7 54.97,21.55
V_LOAD  (via drill 0.4)
  Top 0.305: IC1.1 54.97,19.6 R2.1 55.12,17.53 54.28,16.69 IC6.3 | 38.61,38.63 39.04,39.06 S1.5
  Top 0.508: 38.61,38.63 38.61,34.04 42.8,29.84 45.09,29.84 51.82,23.11 v53.34,23.11 | R2.1 56.63,19.75 56.67,19.79 v56.64,19.81
  Bottom 0.508: v53.34,23.11 v56.64,19.81
V_OK_HYST
  Top 0.254: IC13.9 58.32,43.03 57.81,43.54 ROK2.2 55.5,44.95 ROK3.1
V_OK_PROG
  Top 0.254: IC13.10 57.71,41.85 57.39,42.17 ROK1.2 55.74,42.17 55.26,42.66 ROK2.1
V_REF_2V5
  Top 0.203: IC10.10 20.89,20.98 C35.1
  Top 0.305: R27.2 21.27,20.6 20.89,20.98
V_STR  (via drill 0.3, 0.4)
  Top 0.203: 59.94,38.82 C45.1
  Top 0.254: IC13.15 60.04,38.93 59.94,38.82
  Top 0.305: v59.31,35.18 58.92,34.79 S2.2
  Top 0.406: C45.1 59.31,38.02 59.31,37.72 C44.1
  Top 0.508: C44.1 v60.2,37.47
  Bottom 0.305: v59.31,35.18 58.61,35.88
  Bottom 0.508: JP1.1 58.04,31.5 58.04,35.31 58.61,35.88 v60.2,37.47
V_SUP_DUMMY  (via drill 0.3)
  Top 0.305: IC2.5 44.29,43.48 v44.27,43.46 | S1.4 38.99,39.72 | 38.99,39.72 37.92,39.72 R9.2 | 38.99,39.72 v38.99,40.39
  Bottom 0.305: v38.99,40.39 40.39,40.39 41.2,40.39 v44.27,43.46
V_SUP_TARGET  (via drill 0.3, 0.4)
  Top 0.305: v16.51,45.59 21.21,45.59 P2.1 | S1.6 40.23,38.02 v39.73,37.52 | IC15.3 8.26,47.51 C49.1 v9.34,48.98 v9.35,48.97
  Bottom 0.305: v9.35,48.97 11.73,48.97 15.11,45.59 v16.51,45.59
  Bottom 0.508: P2.1 30.73,42.67 35.89,37.52 v39.73,37.52
V_VBAT_OV
  Top 0.254: IC13.6 60.04,43.91 60.33,44.2 61.09,44.2 61.34,44.45 61.34,44.96 | 61.34,44.96 ROV2.1 | 61.34,44.96 62.17,44.96 ROV1.2
V_VBAT_UV
  Top 0.254: RUV1.2 57.78,44.95 | 57.78,44.95 RUV2.1 | 57.78,44.95 57.78,44.32 58.04,44.07 58.8,44.07 59.05,43.81 59.05,43.09 IC13.8
V_VIN  (via drill 0.3)
  Top 0.305: IC5.16 33.32,21.13 32.64,20.45 v32.64,19.68 | IC6.6 54.28,12.26 54.02,12.53 C24.1 52.15,12.48 R20.2 49.87,12.48 v49.78,12.57
  Bottom 0.305: v32.64,19.68 32.64,18.54 38.61,12.57 v49.78,12.57
V_VOUT  (via drill 0.3)
  Top 0.305: IC5.18 34.1,20.13 v33.66,19.68 | IC6.2 54.94,15.16 54.66,14.88 52.34,14.88 C25.1 50.84,15.03 R21.2 50.25,15.07 v49.78,14.61
  Bottom 0.305: v49.78,14.61 38.73,14.61 v33.66,19.68
V_VRDIV
  Top 0.254: 59.57,45.77 59.57,43.11 IC13.7 | ROK3.2 55.37,45.97 55.58,45.77 58.65,45.77 | 59.57,45.77 58.65,45.77 | ROV2.2 60.48,45.95 60.3,45.77 59.57,45.77 | RUV2.2 58.65,45.77
VDD  (via drill 0.3, 0.35, 0.4)
  Top 0.203: IC10.9 19.39,23.25 | IC12.11 78.35,47.36 79.76,48.77 C40.1
  Top 0.254: IC5.30 42.45,24.63 C19.1 | IC5.9 34.16,24.63 33.91,24.38 33.91,23.37 33.69,23.15 C14.1 | 19.39,23.25 C34.1
  Top 0.305: 33.02,23.11 C14.1 | IC6.8 56.98,11.59 C23.1 | IC4.8 33.83,12.96 C6.1 | C8.1 43.7,15.62 IC3.8 | R31.1 v30.86,20.19 | S2.8 60.83,34.29 60.71,34.42 v60.71,35.94 | R43.2 v77.09,49.15 | TP5.TP 81.28,50.42 v81.03,50.67 | S1.2 46.3,39.06 v47.12,39.88 | IC1.8 49.28,19.44 C2.1 48.47,18.59 v48.26,18.8 | v24.64,19.94 24.64,20.83 24.31,21.16 C31.1 23.72,19.64 IC9.5 | IC15.5 4.59,45.53 C48.1 v3.48,45.51 v3.48,45.52 | v52.07,35.31 51.69,35.31 51.1,34.72 IC8.3 | S4.5 C53.1 51.39,30.05 52.45,31.11 v52.45,31.24 C28.1
  Top 0.406: C19.1 C20.1 46.07,24.73 C18.1 47.17,25.83 v47.17,26.19 | 33.02,23.11 32.98,23.15 C16.1 31.08,22.99 C12.1 v29.21,21.84 | C23.1 57.02,10.92 v57.66,10.29 | C6.1 33.83,15.16 v34.16,15.49 | v34.92,6.22 v34.92,6.23 C11.1 35.8,7.54 R19.1 | C34.1 C33.1 16.34,23.16 C32.1 15.2,23.08 v14.86,22.73 | C8.1 v42.79,16.5 v42.8,16.51 | IC8.1 52.18,32.84 C28.1 | R15.1 31.61,7.89 v31.85,7.64
  Power 0.305: v3.48,45.52 3.48,48.18 6.73,51.44 62.99,51.44 63.5,50.93 v63.5,47.75
  Bottom 0.305: v52.07,35.31 51.69,35.31 v47.12,39.88
  other vias: 81.03,47.37 78.61,50.67 79.88,50.67 78.61,48.64
  pour Power (isolate 0.203, rank 2): 0,54.61 86.36,54.61 86.36,0 0,0
  pour Top: 77.98,46.86 81.53,46.86 81.53,51.31 77.98,51.31
VDD_TARGET
  Top 0.203: IC16.1 12.1,45.78 C50.1
  Top 0.305: R51.1 11.93,46.49 12.1,46.32 12.1,45.78
VOC_SAMP  (via drill 0.3)
  Top 0.203: v64.75,41.83 64.71,41.87 64.7,41.85 IC13.3
  Top 0.305: S2.10 61.81,35.9 v61.8,35.92
  Bottom 0.203: v61.8,35.92 64.75,38.86 v64.75,41.83
VOC_VD
  Top 0.305: S2.9 62.87,34.79 63.12,34.54 63.12,32 P1.4
VREF_SAMP  (via drill 0.3)
  Top 0.254: v61.98,42.93 61.47,42.93 61.27,42.73 IC13.4
  Top 0.305: v60.07,33.27 60.09,33.29 S2.6
  Bottom 0.305: v61.98,42.93 61.98,38.23 60.07,36.32 v60.07,33.27
VSS  (via drill 0.35, 0.4, 0.45)
  Top 0.203: IC12.6 76.14,44.89 76.33,44.7 77.22,44.7 77.34,44.58 C39.1 77.72,43.31 78.49,43.31 78.7,43.09 R45.2
  Top 0.305: IC3.5 45.81,16.84 C7.1 | C3.1 49.28,21.71 IC1.5 | IC9.2 24.64,16.11 C30.1 v24.67,15.3 v24.66,15.29 | TP6.TP 72.07,41.21
  Top 0.406: v48.21,22.55 v48.21,22.56 C3.1 | C7.1 v46.73,16.84 v46.74,16.84
  Top 0.61: v64.52,17.78 65.37,18.64 65.37,34.51 72.07,41.21 72.64,41.78 75.31,41.78 75.82,42.29 75.82,43.18 76.32,43.68 C39.1
  Bottom 0.406: v48.21,22.55 52.98,17.78 v64.52,17.78 63.58,16.84 v46.74,16.84
  Bottom 0.508: v64.52,17.78 64.52,15.75 59.94,11.18 28.78,11.18 v24.66,15.29

## Text on the board
tNames: 1 | 45 | 2 | 46 | 2 | 1 | 1 | 45 | 2 | 46
bStop: SHEPHERD v1.5 / NES TUD